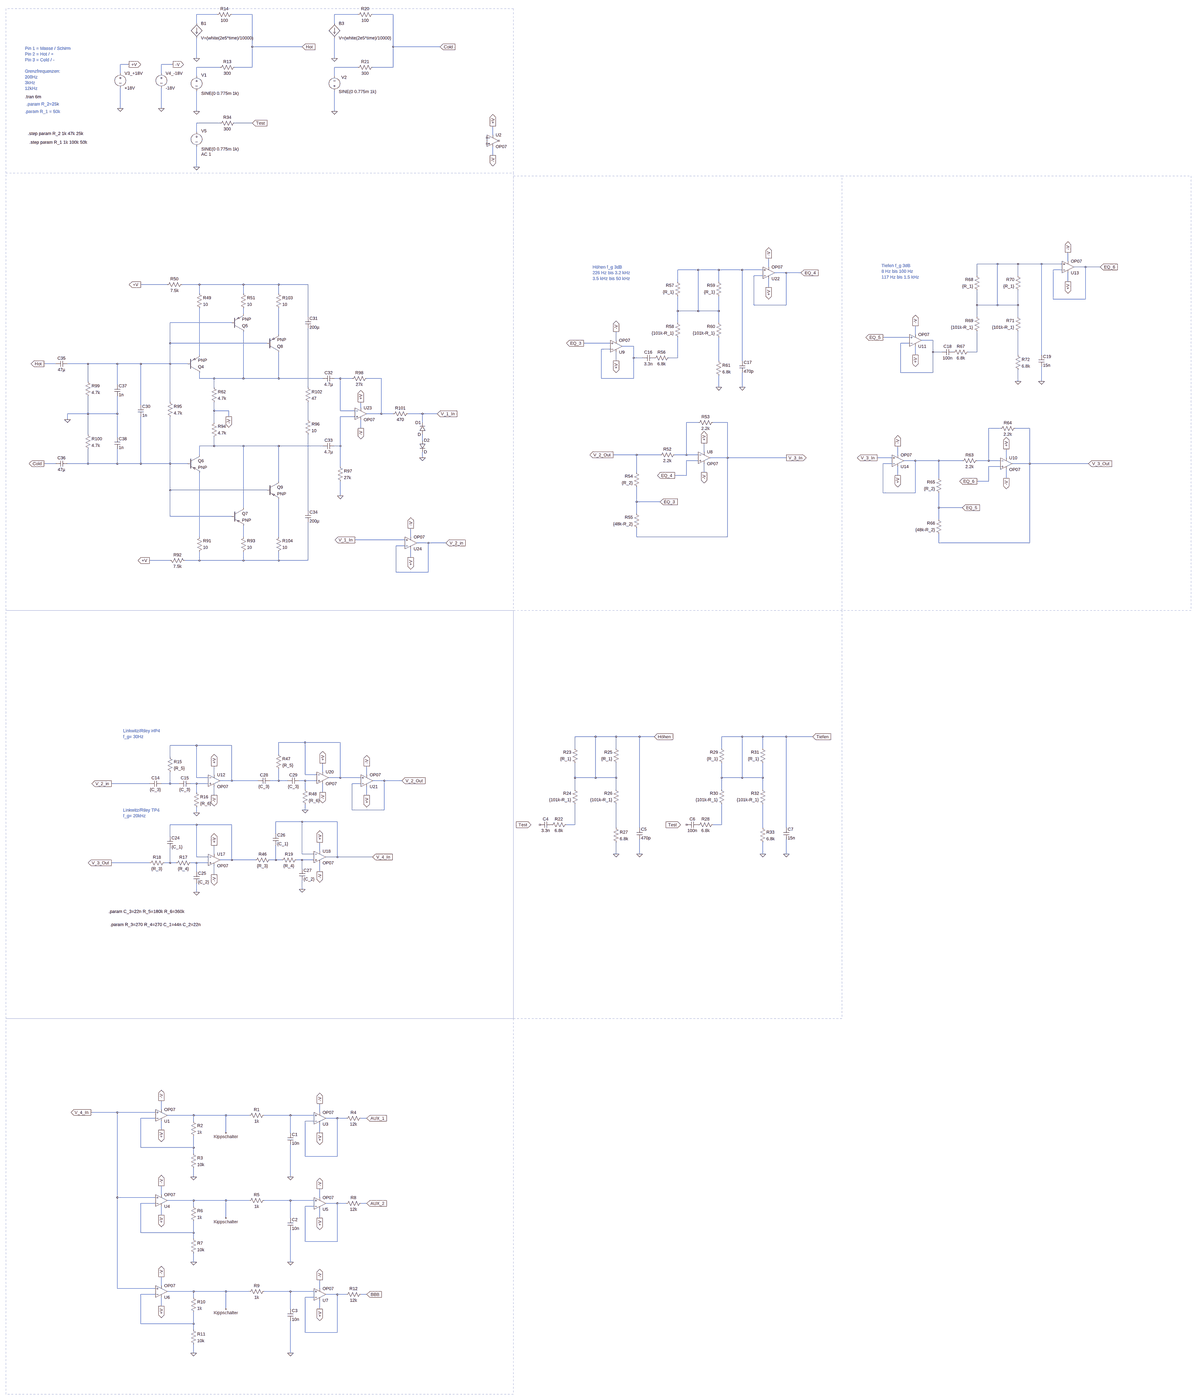
[diagram p0: schematic DiKo_Filter.asc, whole sheet]
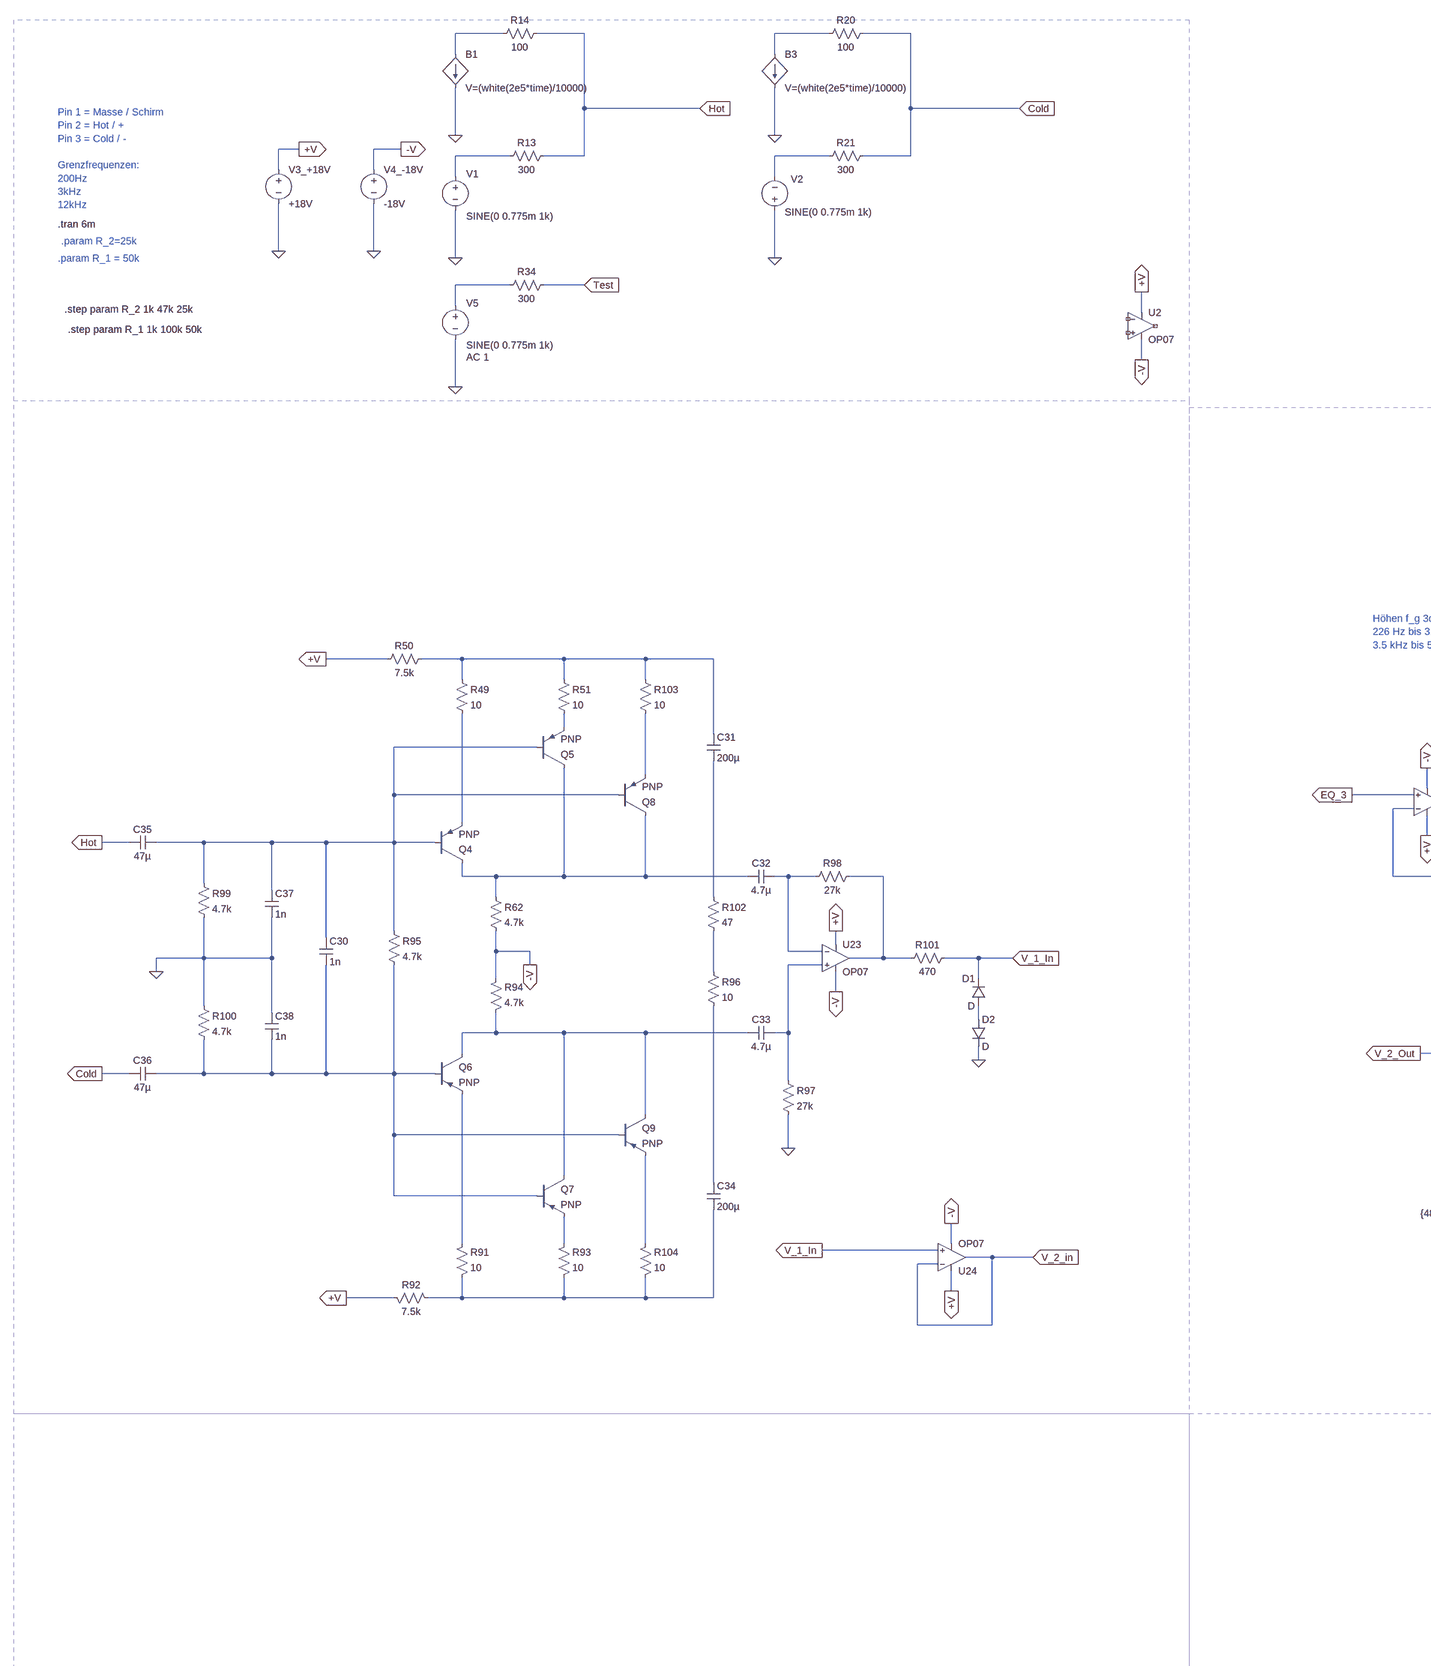
[diagram p1: schematic DiKo_Filter.asc, part, row 1 of 2, column 1 of 2]
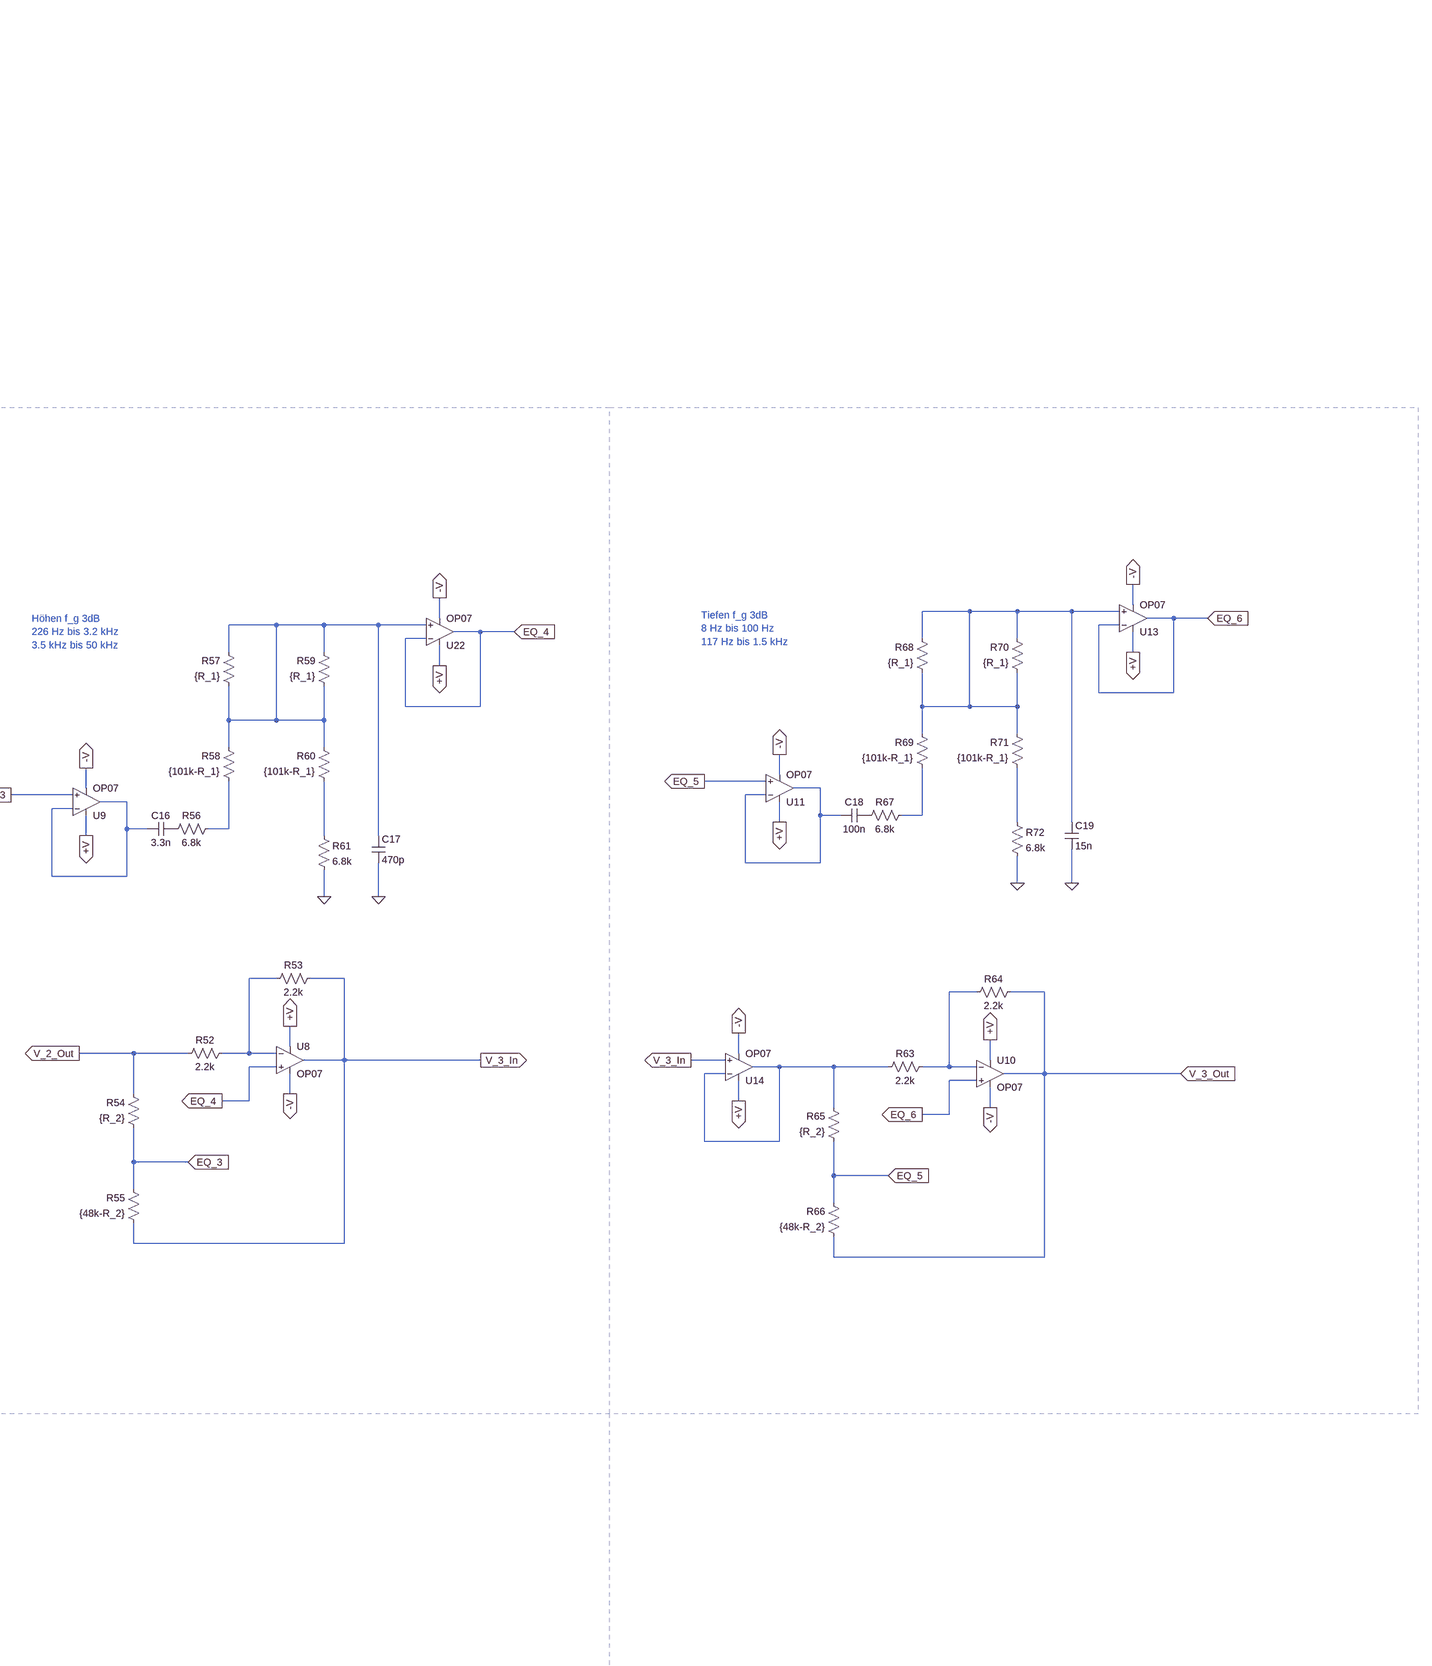
[diagram p2: schematic DiKo_Filter.asc, part, row 1 of 2, column 2 of 2]
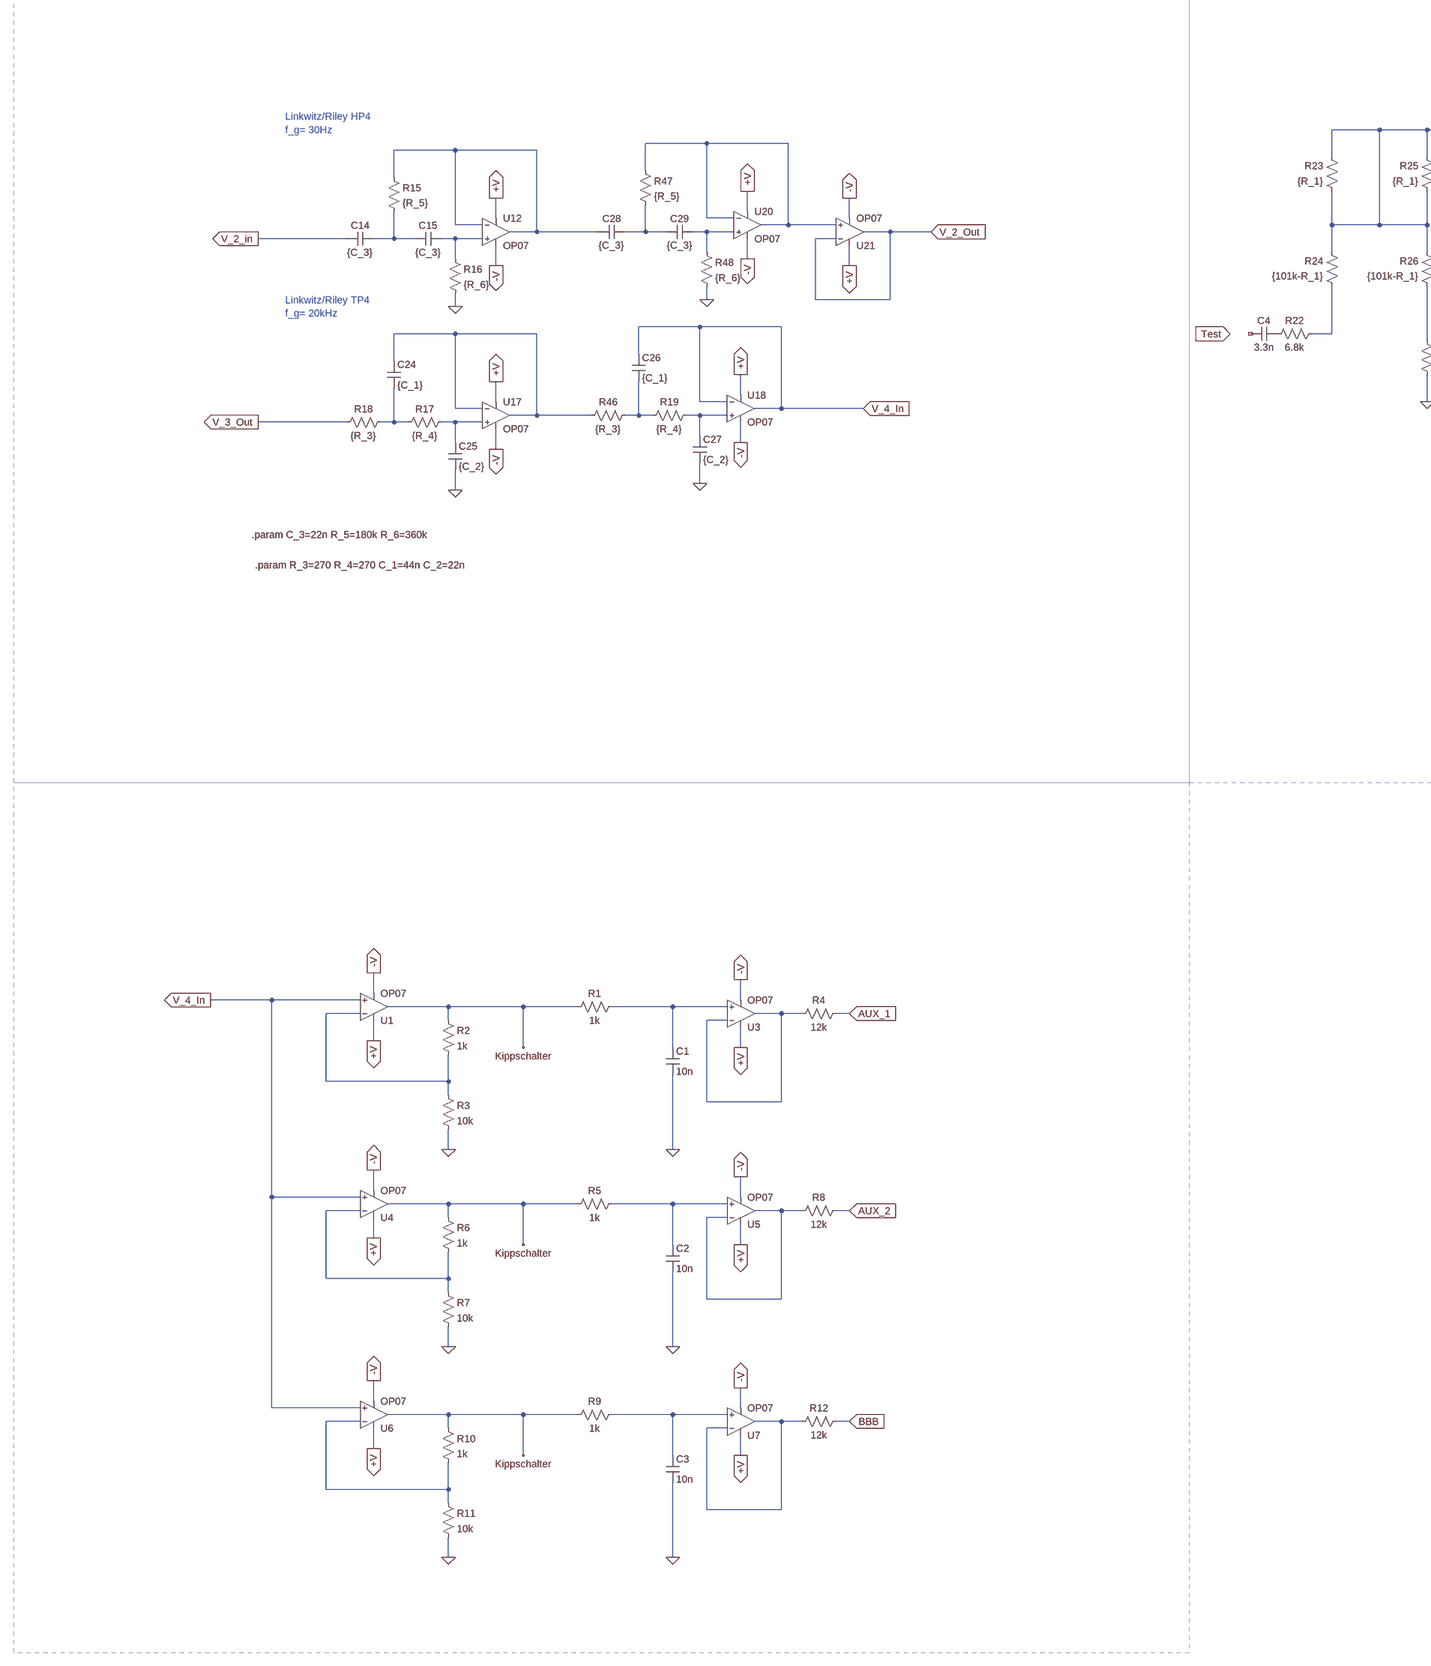
[diagram p3: schematic DiKo_Filter.asc, part, row 2 of 2, column 1 of 2]
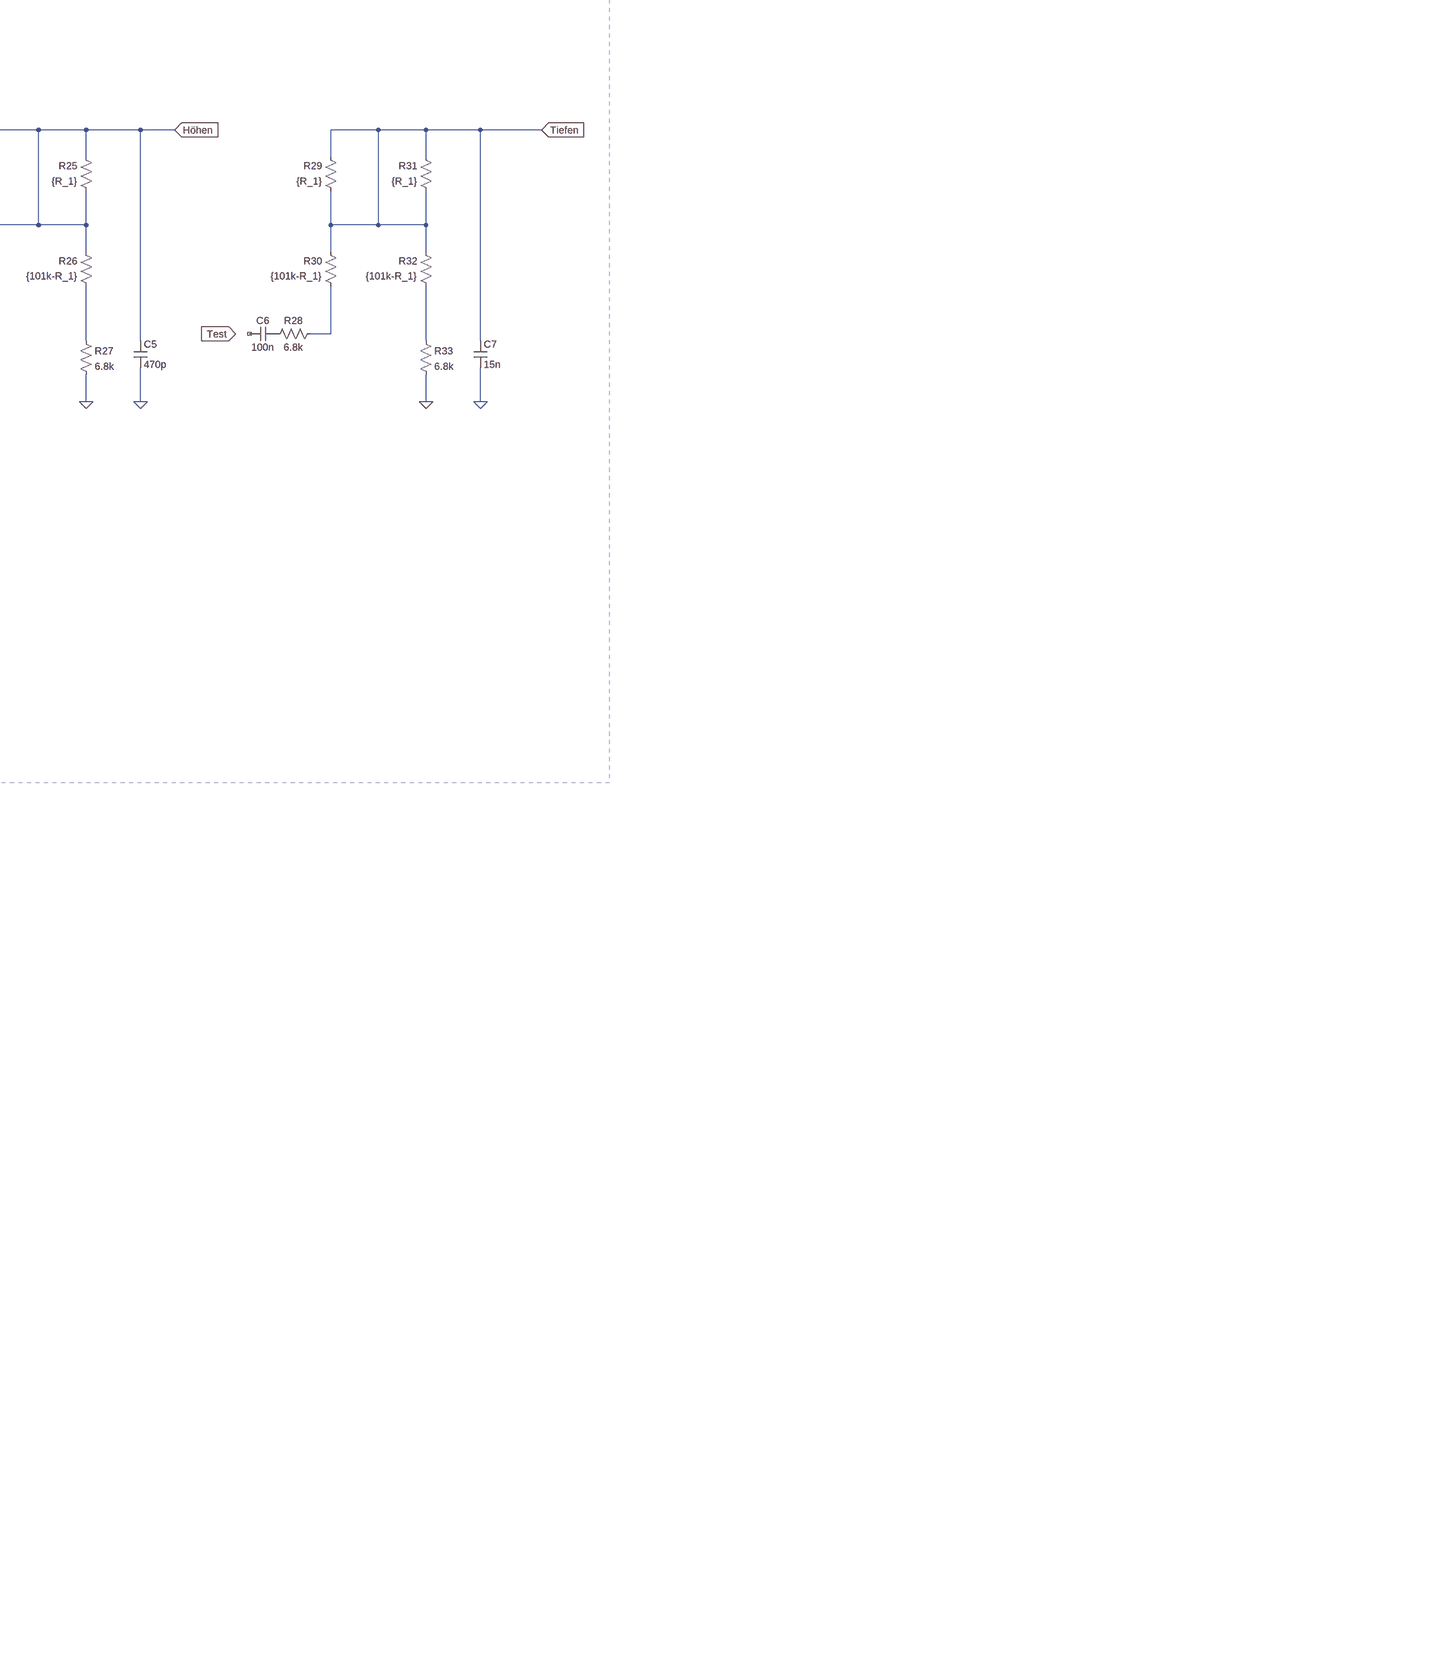
[diagram p4: schematic DiKo_Filter.asc, part, row 2 of 2, column 2 of 2]
DiKo_Filter.asc, the LTspice schematic file:
Version 4
SHEET 1 8660 1460
WIRE 432 -10656 320 -10656
WIRE 624 -10656 512 -10656
WIRE 1200 -10656 1072 -10656
WIRE 1392 -10656 1280 -10656
WIRE 320 -10608 320 -10656
WIRE 1072 -10608 1072 -10656
WIRE 624 -10480 624 -10656
WIRE 896 -10480 624 -10480
WIRE 1392 -10480 1392 -10656
WIRE 1648 -10480 1392 -10480
WIRE 320 -10416 320 -10528
WIRE 1072 -10416 1072 -10528
WIRE -48 -10384 -96 -10384
WIRE 192 -10384 128 -10384
WIRE 448 -10368 320 -10368
WIRE 624 -10368 624 -10480
WIRE 624 -10368 528 -10368
WIRE 1200 -10368 1072 -10368
WIRE 1392 -10368 1392 -10480
WIRE 1392 -10368 1280 -10368
WIRE -96 -10336 -96 -10384
WIRE 128 -10336 128 -10384
WIRE 320 -10320 320 -10368
WIRE 1072 -10320 1072 -10368
WIRE -96 -10144 -96 -10256
WIRE 128 -10144 128 -10256
WIRE 320 -10128 320 -10240
WIRE 1072 -10128 1072 -10240
WIRE 448 -10064 320 -10064
WIRE 624 -10064 528 -10064
WIRE 320 -10016 320 -10064
WIRE 1936 -10000 1936 -10048
WIRE 1936 -9888 1936 -9936
WIRE 320 -9824 320 -9936
WIRE 5072 -9312 5072 -9360
WIRE 4688 -9296 4576 -9296
WIRE 4800 -9296 4688 -9296
WIRE 4928 -9296 4800 -9296
WIRE 5040 -9296 4928 -9296
WIRE 3440 -9280 3440 -9328
WIRE 5168 -9280 5104 -9280
WIRE 5248 -9280 5168 -9280
WIRE 3056 -9264 2944 -9264
WIRE 3168 -9264 3056 -9264
WIRE 3296 -9264 3168 -9264
WIRE 3408 -9264 3296 -9264
WIRE 5040 -9264 4992 -9264
WIRE 3536 -9248 3472 -9248
WIRE 3616 -9248 3536 -9248
WIRE 3408 -9232 3360 -9232
WIRE 4576 -9232 4576 -9296
WIRE 4800 -9232 4800 -9296
WIRE 2944 -9200 2944 -9264
WIRE 3168 -9200 3168 -9264
WIRE 5072 -9200 5072 -9248
WIRE 160 -9184 16 -9184
WIRE 336 -9184 240 -9184
WIRE 576 -9184 336 -9184
WIRE 768 -9184 576 -9184
WIRE 928 -9184 768 -9184
WIRE 3440 -9168 3440 -9216
WIRE 336 -9136 336 -9184
WIRE 576 -9136 576 -9184
WIRE 768 -9136 768 -9184
WIRE 4992 -9104 4992 -9264
WIRE 5168 -9104 5168 -9280
WIRE 5168 -9104 4992 -9104
WIRE 3360 -9072 3360 -9232
WIRE 3536 -9072 3536 -9248
WIRE 3536 -9072 3360 -9072
WIRE 4576 -9072 4576 -9152
WIRE 4688 -9072 4688 -9296
WIRE 4688 -9072 4576 -9072
WIRE 4800 -9072 4800 -9152
WIRE 4800 -9072 4688 -9072
WIRE 2944 -9040 2944 -9120
WIRE 3056 -9040 3056 -9264
WIRE 3056 -9040 2944 -9040
WIRE 3168 -9040 3168 -9120
WIRE 3168 -9040 3056 -9040
WIRE 576 -9024 576 -9056
WIRE 928 -9008 928 -9184
WIRE 4576 -9008 4576 -9072
WIRE 4800 -9008 4800 -9072
WIRE 512 -8976 176 -8976
WIRE 2944 -8976 2944 -9040
WIRE 3168 -8976 3168 -9040
WIRE 768 -8912 768 -9056
WIRE 4240 -8912 4240 -8960
WIRE 4208 -8896 4064 -8896
WIRE 2608 -8880 2608 -8928
WIRE 4336 -8880 4272 -8880
WIRE 176 -8864 176 -8976
WIRE 704 -8864 176 -8864
WIRE 2576 -8864 2432 -8864
WIRE 4208 -8864 4160 -8864
WIRE 2704 -8848 2640 -8848
WIRE 2576 -8832 2528 -8832
WIRE 4336 -8816 4336 -8880
WIRE 4384 -8816 4336 -8816
WIRE 4576 -8816 4576 -8928
WIRE 4576 -8816 4528 -8816
WIRE 336 -8800 336 -9056
WIRE 4240 -8800 4240 -8848
WIRE 4800 -8800 4800 -8928
WIRE 4928 -8800 4928 -9296
WIRE 2704 -8784 2704 -8848
WIRE 2752 -8784 2704 -8784
WIRE 2944 -8784 2944 -8896
WIRE 2944 -8784 2896 -8784
WIRE 2608 -8768 2608 -8816
WIRE 3168 -8768 3168 -8896
WIRE 3296 -8768 3296 -9264
WIRE -448 -8752 -512 -8752
WIRE -272 -8752 -384 -8752
WIRE -112 -8752 -272 -8752
WIRE 16 -8752 -112 -8752
WIRE 176 -8752 176 -8864
WIRE 176 -8752 16 -8752
WIRE 272 -8752 176 -8752
WIRE 4160 -8704 4160 -8864
WIRE 4336 -8704 4336 -8816
WIRE 4336 -8704 4160 -8704
WIRE 336 -8672 336 -8704
WIRE 416 -8672 336 -8672
WIRE 576 -8672 576 -8928
WIRE 576 -8672 416 -8672
WIRE 768 -8672 768 -8816
WIRE 768 -8672 576 -8672
WIRE 1008 -8672 768 -8672
WIRE 1104 -8672 1072 -8672
WIRE 1168 -8672 1104 -8672
WIRE 1328 -8672 1248 -8672
WIRE 2528 -8672 2528 -8832
WIRE 2704 -8672 2704 -8784
WIRE 2704 -8672 2528 -8672
WIRE -272 -8656 -272 -8752
WIRE 4800 -8656 4800 -8720
WIRE 4928 -8656 4928 -8736
WIRE -112 -8640 -112 -8752
WIRE 416 -8624 416 -8672
WIRE 928 -8624 928 -8944
WIRE 3168 -8624 3168 -8688
WIRE 3296 -8624 3296 -8704
WIRE 176 -8544 176 -8752
WIRE 16 -8528 16 -8752
WIRE 1216 -8512 1216 -8544
WIRE 416 -8496 416 -8544
WIRE 496 -8496 416 -8496
WIRE 1104 -8496 1104 -8672
WIRE 1184 -8496 1104 -8496
WIRE -272 -8480 -272 -8576
WIRE -272 -8480 -384 -8480
WIRE -112 -8480 -112 -8576
WIRE -112 -8480 -272 -8480
WIRE 1328 -8480 1328 -8672
WIRE 1328 -8480 1248 -8480
WIRE 1392 -8480 1328 -8480
WIRE 1552 -8480 1472 -8480
WIRE 1632 -8480 1552 -8480
WIRE 496 -8464 496 -8496
WIRE 1184 -8464 1104 -8464
WIRE -384 -8448 -384 -8480
WIRE 928 -8448 928 -8544
WIRE 416 -8432 416 -8496
WIRE 1552 -8432 1552 -8480
WIRE 3056 -8432 2992 -8432
WIRE 3216 -8432 3136 -8432
WIRE 1216 -8400 1216 -8448
WIRE 4704 -8400 4640 -8400
WIRE 4864 -8400 4784 -8400
WIRE -272 -8368 -272 -8480
WIRE -112 -8352 -112 -8480
WIRE 1552 -8336 1552 -8368
WIRE 416 -8304 416 -8352
WIRE 416 -8304 336 -8304
WIRE 576 -8304 416 -8304
WIRE 768 -8304 576 -8304
WIRE 1008 -8304 768 -8304
WIRE 1104 -8304 1104 -8464
WIRE 1104 -8304 1072 -8304
WIRE 3088 -8272 3088 -8320
WIRE 336 -8256 336 -8304
WIRE 2720 -8256 2592 -8256
WIRE 2848 -8256 2720 -8256
WIRE 2992 -8256 2992 -8432
WIRE 2992 -8256 2928 -8256
WIRE 3056 -8256 2992 -8256
WIRE 4144 -8256 4144 -8304
WIRE 1552 -8240 1552 -8272
WIRE 3216 -8240 3216 -8432
WIRE 3216 -8240 3120 -8240
WIRE 3536 -8240 3216 -8240
WIRE 4112 -8240 4032 -8240
WIRE 4736 -8240 4736 -8288
WIRE 3056 -8224 2992 -8224
WIRE 4240 -8224 4176 -8224
WIRE 4368 -8224 4240 -8224
WIRE 4496 -8224 4368 -8224
WIRE 4640 -8224 4640 -8400
WIRE 4640 -8224 4576 -8224
WIRE 4704 -8224 4640 -8224
WIRE -448 -8208 -512 -8208
WIRE -272 -8208 -272 -8288
WIRE -272 -8208 -384 -8208
WIRE -112 -8208 -112 -8288
WIRE -112 -8208 -272 -8208
WIRE 16 -8208 16 -8464
WIRE 16 -8208 -112 -8208
WIRE 176 -8208 176 -8464
WIRE 176 -8208 16 -8208
WIRE 272 -8208 176 -8208
WIRE 4112 -8208 4064 -8208
WIRE 4864 -8208 4864 -8400
WIRE 4864 -8208 4768 -8208
WIRE 5184 -8208 4864 -8208
WIRE 1104 -8192 1104 -8304
WIRE 4704 -8192 4640 -8192
WIRE 2720 -8160 2720 -8256
WIRE 3088 -8160 3088 -8208
WIRE 2992 -8144 2992 -8224
WIRE 2992 -8144 2928 -8144
WIRE 4144 -8144 4144 -8192
WIRE 4368 -8128 4368 -8224
WIRE 4736 -8128 4736 -8176
WIRE 768 -8112 768 -8304
WIRE 4640 -8112 4640 -8192
WIRE 4640 -8112 4576 -8112
WIRE 176 -8064 176 -8208
WIRE 704 -8064 176 -8064
WIRE 4064 -8048 4064 -8208
WIRE 4240 -8048 4240 -8224
WIRE 4240 -8048 4064 -8048
WIRE 1104 -8032 1104 -8112
WIRE 2720 -8000 2720 -8080
WIRE 2848 -8000 2720 -8000
WIRE 576 -7968 576 -8304
WIRE 4368 -7968 4368 -8048
WIRE 4496 -7968 4368 -7968
WIRE 928 -7952 928 -8368
WIRE 2720 -7936 2720 -8000
WIRE 176 -7920 176 -8064
WIRE 512 -7920 176 -7920
WIRE 4368 -7904 4368 -7968
WIRE 336 -7808 336 -8160
WIRE 576 -7808 576 -7872
WIRE 768 -7808 768 -8016
WIRE 1488 -7808 1488 -7856
WIRE 2720 -7808 2720 -7856
WIRE 3216 -7808 3216 -8240
WIRE 3216 -7808 2720 -7808
WIRE 1456 -7792 1184 -7792
WIRE 1584 -7776 1520 -7776
WIRE 1680 -7776 1584 -7776
WIRE 4368 -7776 4368 -7824
WIRE 4864 -7776 4864 -8208
WIRE 4864 -7776 4368 -7776
WIRE 1456 -7760 1408 -7760
WIRE 1488 -7696 1488 -7744
WIRE 176 -7680 64 -7680
WIRE 336 -7680 336 -7728
WIRE 336 -7680 256 -7680
WIRE 576 -7680 576 -7728
WIRE 576 -7680 336 -7680
WIRE 768 -7680 768 -7728
WIRE 768 -7680 576 -7680
WIRE 928 -7680 928 -7888
WIRE 928 -7680 768 -7680
WIRE 1408 -7616 1408 -7760
WIRE 1584 -7616 1584 -7776
WIRE 1584 -7616 1408 -7616
WIRE 2496 -6720 2384 -6720
WIRE 2608 -6720 2496 -6720
WIRE 2736 -6720 2608 -6720
WIRE 2816 -6720 2736 -6720
WIRE 3296 -6720 3184 -6720
WIRE 3408 -6720 3296 -6720
WIRE 3536 -6720 3408 -6720
WIRE 3680 -6720 3536 -6720
WIRE 912 -6688 768 -6688
WIRE 1104 -6688 912 -6688
WIRE 320 -6672 176 -6672
WIRE 512 -6672 320 -6672
WIRE 2384 -6656 2384 -6720
WIRE 2608 -6656 2608 -6720
WIRE 3184 -6656 3184 -6720
WIRE 3408 -6656 3408 -6720
WIRE 768 -6624 768 -6688
WIRE 176 -6608 176 -6672
WIRE 1008 -6528 1008 -6576
WIRE 416 -6512 416 -6560
WIRE 912 -6512 912 -6688
WIRE 976 -6512 912 -6512
WIRE 1248 -6512 1248 -6560
WIRE 320 -6496 320 -6672
WIRE 384 -6496 320 -6496
WIRE 1104 -6496 1104 -6688
WIRE 1104 -6496 1040 -6496
WIRE 1216 -6496 1104 -6496
WIRE 2384 -6496 2384 -6576
WIRE 2496 -6496 2496 -6720
WIRE 2496 -6496 2384 -6496
WIRE 2608 -6496 2608 -6576
WIRE 2608 -6496 2496 -6496
WIRE 3184 -6496 3184 -6576
WIRE 3296 -6496 3296 -6720
WIRE 3296 -6496 3184 -6496
WIRE 3408 -6496 3408 -6576
WIRE 3408 -6496 3296 -6496
WIRE 512 -6480 512 -6672
WIRE 512 -6480 448 -6480
WIRE 656 -6480 512 -6480
WIRE 768 -6480 768 -6544
WIRE 768 -6480 720 -6480
WIRE 816 -6480 768 -6480
WIRE 912 -6480 880 -6480
WIRE 976 -6480 912 -6480
WIRE 1344 -6480 1280 -6480
WIRE 1440 -6480 1344 -6480
WIRE 64 -6464 -144 -6464
WIRE 176 -6464 176 -6528
WIRE 176 -6464 128 -6464
WIRE 224 -6464 176 -6464
WIRE 320 -6464 288 -6464
WIRE 384 -6464 320 -6464
WIRE 1216 -6464 1168 -6464
WIRE 912 -6432 912 -6480
WIRE 2384 -6432 2384 -6496
WIRE 2608 -6432 2608 -6496
WIRE 3184 -6432 3184 -6496
WIRE 3408 -6432 3408 -6496
WIRE 320 -6416 320 -6464
WIRE 1008 -6416 1008 -6464
WIRE 416 -6400 416 -6448
WIRE 1248 -6400 1248 -6448
WIRE 912 -6320 912 -6352
WIRE 1168 -6320 1168 -6464
WIRE 1344 -6320 1344 -6480
WIRE 1344 -6320 1168 -6320
WIRE 320 -6304 320 -6336
WIRE 896 -6256 752 -6256
WIRE 1088 -6256 896 -6256
WIRE 320 -6240 176 -6240
WIRE 512 -6240 320 -6240
WIRE 2384 -6240 2384 -6352
WIRE 2384 -6240 2336 -6240
WIRE 3184 -6240 3184 -6352
WIRE 3184 -6240 3136 -6240
WIRE 2608 -6224 2608 -6352
WIRE 2736 -6224 2736 -6720
WIRE 3408 -6224 3408 -6352
WIRE 3536 -6224 3536 -6720
WIRE 752 -6192 752 -6256
WIRE 176 -6176 176 -6240
WIRE 992 -6096 992 -6144
WIRE 416 -6080 416 -6128
WIRE 896 -6080 896 -6256
WIRE 960 -6080 896 -6080
WIRE 2608 -6080 2608 -6144
WIRE 2736 -6080 2736 -6160
WIRE 3408 -6080 3408 -6144
WIRE 3536 -6080 3536 -6160
WIRE 320 -6064 320 -6240
WIRE 384 -6064 320 -6064
WIRE 1088 -6064 1088 -6256
WIRE 1088 -6064 1024 -6064
WIRE 1280 -6064 1088 -6064
WIRE 512 -6048 512 -6240
WIRE 512 -6048 448 -6048
WIRE 640 -6048 512 -6048
WIRE 752 -6048 752 -6128
WIRE 752 -6048 720 -6048
WIRE 784 -6048 752 -6048
WIRE 896 -6048 864 -6048
WIRE 960 -6048 896 -6048
WIRE 64 -6032 -144 -6032
WIRE 176 -6032 176 -6112
WIRE 176 -6032 144 -6032
WIRE 208 -6032 176 -6032
WIRE 320 -6032 288 -6032
WIRE 384 -6032 320 -6032
WIRE 896 -6000 896 -6048
WIRE 320 -5984 320 -6032
WIRE 992 -5984 992 -6032
WIRE 416 -5968 416 -6016
WIRE 896 -5888 896 -5936
WIRE 320 -5872 320 -5920
WIRE 128 -4688 128 -4736
WIRE -112 -4672 -256 -4672
WIRE 96 -4672 -112 -4672
WIRE 992 -4672 992 -4720
WIRE 304 -4656 160 -4656
WIRE 480 -4656 304 -4656
WIRE 608 -4656 480 -4656
WIRE 832 -4656 688 -4656
WIRE 960 -4656 832 -4656
WIRE 96 -4640 16 -4640
WIRE 1088 -4640 1024 -4640
WIRE 1136 -4640 1088 -4640
WIRE 1248 -4640 1216 -4640
WIRE 304 -4624 304 -4656
WIRE 960 -4624 912 -4624
WIRE 128 -4576 128 -4624
WIRE 480 -4560 480 -4656
WIRE 832 -4560 832 -4656
WIRE 992 -4560 992 -4608
WIRE 16 -4480 16 -4640
WIRE 304 -4480 304 -4544
WIRE 304 -4480 16 -4480
WIRE 304 -4448 304 -4480
WIRE 912 -4432 912 -4624
WIRE 1088 -4432 1088 -4640
WIRE 1088 -4432 912 -4432
WIRE 304 -4320 304 -4368
WIRE 832 -4320 832 -4496
WIRE 128 -4224 128 -4272
WIRE -112 -4208 -112 -4672
WIRE 96 -4208 -112 -4208
WIRE 992 -4208 992 -4256
WIRE 304 -4192 160 -4192
WIRE 480 -4192 304 -4192
WIRE 608 -4192 480 -4192
WIRE 832 -4192 688 -4192
WIRE 960 -4192 832 -4192
WIRE 96 -4176 16 -4176
WIRE 1088 -4176 1024 -4176
WIRE 1136 -4176 1088 -4176
WIRE 1248 -4176 1216 -4176
WIRE 304 -4160 304 -4192
WIRE 960 -4160 912 -4160
WIRE 128 -4112 128 -4160
WIRE 480 -4096 480 -4192
WIRE 832 -4096 832 -4192
WIRE 992 -4096 992 -4144
WIRE 16 -4016 16 -4176
WIRE 304 -4016 304 -4080
WIRE 304 -4016 16 -4016
WIRE 304 -3984 304 -4016
WIRE 912 -3968 912 -4160
WIRE 1088 -3968 1088 -4176
WIRE 1088 -3968 912 -3968
WIRE 304 -3856 304 -3904
WIRE 832 -3856 832 -4032
WIRE 128 -3728 128 -3776
WIRE -112 -3712 -112 -4208
WIRE 96 -3712 -112 -3712
WIRE 992 -3712 992 -3760
WIRE 304 -3696 160 -3696
WIRE 480 -3696 304 -3696
WIRE 608 -3696 480 -3696
WIRE 832 -3696 688 -3696
WIRE 960 -3696 832 -3696
WIRE 96 -3680 16 -3680
WIRE 1088 -3680 1024 -3680
WIRE 1136 -3680 1088 -3680
WIRE 1248 -3680 1216 -3680
WIRE 304 -3664 304 -3696
WIRE 960 -3664 912 -3664
WIRE 128 -3616 128 -3664
WIRE 480 -3600 480 -3696
WIRE 832 -3600 832 -3696
WIRE 992 -3600 992 -3648
WIRE 16 -3520 16 -3680
WIRE 304 -3520 304 -3584
WIRE 304 -3520 16 -3520
WIRE 304 -3488 304 -3520
WIRE 912 -3472 912 -3664
WIRE 1088 -3472 1088 -3680
WIRE 1088 -3472 912 -3472
WIRE 304 -3360 304 -3408
WIRE 832 -3360 832 -3536
FLAG 320 -10128 0
FLAG -96 -10144 0
FLAG 128 -10144 0
FLAG -48 -10384 +V
IOPIN -48 -10384 Out
FLAG 192 -10384 -V
IOPIN 192 -10384 Out
FLAG 1936 -10048 +V
IOPIN 1936 -10048 Out
FLAG 1936 -9888 -V
IOPIN 1936 -9888 Out
FLAG 3088 -8320 +V
IOPIN 3088 -8320 Out
FLAG 3088 -8160 -V
IOPIN 3088 -8160 Out
FLAG -144 -6464 V_2_in
IOPIN -144 -6464 Out
FLAG 2848 -8000 EQ_3
IOPIN 2848 -8000 In
FLAG 2928 -8144 EQ_4
IOPIN 2928 -8144 Out
FLAG 3168 -8624 0
FLAG 3296 -8624 0
FLAG 2608 -8768 +V
IOPIN 2608 -8768 Out
FLAG 2608 -8928 -V
IOPIN 2608 -8928 Out
FLAG 2432 -8864 EQ_3
IOPIN 2432 -8864 Out
FLAG 3616 -9248 EQ_4
IOPIN 3616 -9248 In
FLAG 4736 -8288 +V
IOPIN 4736 -8288 Out
FLAG 4736 -8128 -V
IOPIN 4736 -8128 Out
FLAG 4496 -7968 EQ_5
IOPIN 4496 -7968 In
FLAG 4576 -8112 EQ_6
IOPIN 4576 -8112 Out
FLAG 4800 -8656 0
FLAG 4928 -8656 0
FLAG 4240 -8800 +V
IOPIN 4240 -8800 Out
FLAG 4240 -8960 -V
IOPIN 4240 -8960 Out
FLAG 4064 -8896 EQ_5
IOPIN 4064 -8896 Out
FLAG 5248 -9280 EQ_6
IOPIN 5248 -9280 In
FLAG 416 -6560 +V
IOPIN 416 -6560 Out
FLAG 416 -6400 -V
IOPIN 416 -6400 Out
FLAG 320 -6304 0
FLAG 416 -6128 +V
IOPIN 416 -6128 Out
FLAG 416 -5968 -V
IOPIN 416 -5968 Out
FLAG 320 -5872 0
FLAG 992 -6144 +V
IOPIN 992 -6144 Out
FLAG 992 -5984 -V
IOPIN 992 -5984 Out
FLAG 896 -5888 0
FLAG 1008 -6576 +V
IOPIN 1008 -6576 Out
FLAG 1008 -6416 -V
IOPIN 1008 -6416 Out
FLAG 1248 -6400 +V
IOPIN 1248 -6400 Out
FLAG 1248 -6560 -V
IOPIN 1248 -6560 Out
FLAG 912 -6320 0
FLAG 3440 -9168 +V
IOPIN 3440 -9168 Out
FLAG 3440 -9328 -V
IOPIN 3440 -9328 Out
FLAG 1184 -7792 V_1_In
IOPIN 1184 -7792 Out
FLAG 5184 -8208 V_3_Out
IOPIN 5184 -8208 In
FLAG 3536 -8240 V_3_In
IOPIN 3536 -8240 Out
FLAG 2592 -8256 V_2_Out
IOPIN 2592 -8256 Out
FLAG 1440 -6480 V_2_Out
IOPIN 1440 -6480 In
FLAG 1488 -7696 +V
IOPIN 1488 -7696 Out
FLAG 1488 -7856 -V
IOPIN 1488 -7856 Out
FLAG 1680 -7776 V_2_in
IOPIN 1680 -7776 In
FLAG -144 -6032 V_3_Out
IOPIN -144 -6032 Out
FLAG 1280 -6064 V_4_In
IOPIN 1280 -6064 In
FLAG 1072 -10128 0
FLAG 1648 -10480 Cold
IOPIN 1648 -10480 In
FLAG -512 -8752 Hot
IOPIN -512 -8752 Out
FLAG -512 -8208 Cold
IOPIN -512 -8208 Out
FLAG 16 -9184 +V
IOPIN 16 -9184 Out
FLAG 64 -7680 +V
IOPIN 64 -7680 Out
FLAG 496 -8464 -V
IOPIN 496 -8464 Out
FLAG 1216 -8544 +V
IOPIN 1216 -8544 Out
FLAG 1216 -8400 -V
IOPIN 1216 -8400 Out
FLAG 1104 -8032 0
FLAG -384 -8448 0
FLAG 1632 -8480 V_1_In
IOPIN 1632 -8480 In
FLAG 1552 -8240 0
FLAG -256 -4672 V_4_In
IOPIN -256 -4672 Out
FLAG 1248 -4640 AUX_1
IOPIN 1248 -4640 In
FLAG 128 -4576 +V
IOPIN 128 -4576 Out
FLAG 128 -4736 -V
IOPIN 128 -4736 Out
FLAG 832 -4320 0
FLAG 992 -4560 +V
IOPIN 992 -4560 Out
FLAG 992 -4720 -V
IOPIN 992 -4720 Out
FLAG 304 -4320 0
FLAG 128 -4112 +V
IOPIN 128 -4112 Out
FLAG 128 -4272 -V
IOPIN 128 -4272 Out
FLAG 832 -3856 0
FLAG 992 -4096 +V
IOPIN 992 -4096 Out
FLAG 992 -4256 -V
IOPIN 992 -4256 Out
FLAG 304 -3856 0
FLAG 1248 -4176 AUX_2
IOPIN 1248 -4176 In
FLAG 128 -3616 +V
IOPIN 128 -3616 Out
FLAG 128 -3776 -V
IOPIN 128 -3776 Out
FLAG 832 -3360 0
FLAG 992 -3600 +V
IOPIN 992 -3600 Out
FLAG 992 -3760 -V
IOPIN 992 -3760 Out
FLAG 304 -3360 0
FLAG 1248 -3680 BBB
IOPIN 1248 -3680 In
FLAG 5072 -9200 +V
IOPIN 5072 -9200 Out
FLAG 5072 -9360 -V
IOPIN 5072 -9360 Out
FLAG 480 -4560 Kippschalter
FLAG 480 -4096 Kippschalter
FLAG 480 -3600 Kippschalter
FLAG 4144 -8144 +V
IOPIN 4144 -8144 Out
FLAG 4144 -8304 -V
IOPIN 4144 -8304 Out
FLAG 4032 -8240 V_3_In
IOPIN 4032 -8240 Out
FLAG 320 -10416 0
FLAG 896 -10480 Hot
IOPIN 896 -10480 In
FLAG 1072 -10416 0
FLAG 2608 -6080 0
FLAG 2736 -6080 0
FLAG 2144 -6240 Test
IOPIN 2144 -6240 In
FLAG 3408 -6080 0
FLAG 3536 -6080 0
FLAG 2960 -6240 Test
IOPIN 2960 -6240 In
FLAG 320 -9824 0
FLAG 624 -10064 Test
IOPIN 624 -10064 In
FLAG 2816 -6720 Höhen
IOPIN 2816 -6720 In
FLAG 3680 -6720 Tiefen
IOPIN 3680 -6720 In
SYMBOL voltage 320 -10336 R0
WINDOW 123 26 137 Left 2
WINDOW 39 0 0 Left 0
WINDOW 3 26 109 Left 2
WINDOW 0 26 10 Left 2
SYMATTR Value SINE(0 0.775m 1k)
SYMATTR InstName V1
SYMBOL voltage -96 -10352 R0
WINDOW 123 0 0 Left 0
WINDOW 39 0 0 Left 0
SYMATTR InstName V3_+18V
SYMATTR Value +18V
SYMBOL voltage 128 -10352 R0
WINDOW 123 0 0 Left 0
WINDOW 39 0 0 Left 0
SYMATTR InstName V4_-18V
SYMATTR Value -18V
SYMBOL OpAmps\\OP07 1936 -10032 R0
SYMATTR InstName U2
SYMBOL OpAmps\\OP07 3088 -8304 R0
SYMATTR InstName U8
SYMBOL res 2944 -8272 R90
WINDOW 0 0 56 VBottom 2
WINDOW 3 32 56 VTop 2
SYMATTR InstName R52
SYMATTR Value 2.2k
SYMBOL res 3152 -8448 R90
WINDOW 0 0 56 VBottom 2
WINDOW 3 32 56 VTop 2
SYMATTR InstName R53
SYMATTR Value 2.2k
SYMBOL res 2736 -8064 R180
WINDOW 0 36 76 Left 2
WINDOW 3 36 40 Left 2
SYMATTR InstName R54
SYMATTR Value {R_2}
SYMBOL res 2736 -7840 R180
WINDOW 0 36 76 Left 2
WINDOW 3 36 40 Left 2
SYMATTR InstName R55
SYMATTR Value {48k-R_2}
SYMBOL cap 2816 -8800 R90
WINDOW 0 0 32 VBottom 2
WINDOW 3 32 32 VTop 2
SYMATTR InstName C16
SYMATTR Value 3.3n
SYMBOL res 2912 -8800 R90
WINDOW 0 0 56 VBottom 2
WINDOW 3 32 56 VTop 2
SYMATTR InstName R56
SYMATTR Value 6.8k
SYMBOL res 2960 -9104 R180
WINDOW 0 36 76 Left 2
WINDOW 3 36 40 Left 2
SYMATTR InstName R57
SYMATTR Value {R_1}
SYMBOL res 2960 -8880 R180
WINDOW 0 36 76 Left 2
WINDOW 3 36 40 Left 2
SYMATTR InstName R58
SYMATTR Value {101k-R_1}
SYMBOL res 3184 -9104 R180
WINDOW 0 36 76 Left 2
WINDOW 3 36 40 Left 2
SYMATTR InstName R59
SYMATTR Value {R_1}
SYMBOL res 3184 -8880 R180
WINDOW 0 36 76 Left 2
WINDOW 3 36 40 Left 2
SYMATTR InstName R60
SYMATTR Value {101k-R_1}
SYMBOL res 3152 -8784 R0
SYMATTR InstName R61
SYMATTR Value 6.8k
SYMBOL cap 3280 -8768 R0
SYMATTR InstName C17
SYMATTR Value 470p
SYMBOL OpAmps\\OP07 2608 -8784 M180
SYMATTR InstName U9
SYMBOL OpAmps\\OP07 4736 -8272 R0
SYMATTR InstName U10
SYMBOL res 4592 -8240 R90
WINDOW 0 0 56 VBottom 2
WINDOW 3 32 56 VTop 2
SYMATTR InstName R63
SYMATTR Value 2.2k
SYMBOL res 4800 -8416 R90
WINDOW 0 0 56 VBottom 2
WINDOW 3 32 56 VTop 2
SYMATTR InstName R64
SYMATTR Value 2.2k
SYMBOL res 4384 -8032 R180
WINDOW 0 36 76 Left 2
WINDOW 3 36 40 Left 2
SYMATTR InstName R65
SYMATTR Value {R_2}
SYMBOL res 4384 -7808 R180
WINDOW 0 36 76 Left 2
WINDOW 3 36 40 Left 2
SYMATTR InstName R66
SYMATTR Value {48k-R_2}
SYMBOL cap 4448 -8832 R90
WINDOW 0 0 32 VBottom 2
WINDOW 3 32 32 VTop 2
SYMATTR InstName C18
SYMATTR Value 100n
SYMBOL res 4544 -8832 R90
WINDOW 0 0 56 VBottom 2
WINDOW 3 32 56 VTop 2
SYMATTR InstName R67
SYMATTR Value 6.8k
SYMBOL res 4592 -9136 R180
WINDOW 0 36 76 Left 2
WINDOW 3 36 40 Left 2
SYMATTR InstName R68
SYMATTR Value {R_1}
SYMBOL res 4592 -8912 R180
WINDOW 0 36 76 Left 2
WINDOW 3 36 40 Left 2
SYMATTR InstName R69
SYMATTR Value {101k-R_1}
SYMBOL res 4816 -9136 R180
WINDOW 0 36 76 Left 2
WINDOW 3 36 40 Left 2
SYMATTR InstName R70
SYMATTR Value {R_1}
SYMBOL res 4816 -8912 R180
WINDOW 0 36 76 Left 2
WINDOW 3 36 40 Left 2
SYMATTR InstName R71
SYMATTR Value {101k-R_1}
SYMBOL res 4784 -8816 R0
SYMATTR InstName R72
SYMATTR Value 6.8k
SYMBOL cap 4912 -8800 R0
SYMATTR InstName C19
SYMATTR Value 15n
SYMBOL OpAmps\\OP07 4240 -8816 M180
SYMATTR InstName U11
SYMBOL OpAmps\\OP07 416 -6544 R0
SYMATTR InstName U12
SYMBOL cap 128 -6480 R90
WINDOW 0 0 32 VBottom 2
WINDOW 3 32 32 VTop 2
SYMATTR InstName C14
SYMATTR Value {C_3}
SYMBOL cap 288 -6480 R90
WINDOW 0 0 32 VBottom 2
WINDOW 3 32 32 VTop 2
SYMATTR InstName C15
SYMATTR Value {C_3}
SYMBOL res 160 -6624 R0
SYMATTR InstName R15
SYMATTR Value {R_5}
SYMBOL res 304 -6432 R0
SYMATTR InstName R16
SYMATTR Value {R_6}
SYMBOL OpAmps\\OP07 416 -6112 R0
SYMATTR InstName U17
SYMBOL res 304 -6048 R90
WINDOW 0 0 56 VBottom 2
WINDOW 3 32 56 VTop 2
SYMATTR InstName R17
SYMATTR Value {R_4}
SYMBOL res 160 -6048 R90
WINDOW 0 0 56 VBottom 2
WINDOW 3 32 56 VTop 2
SYMATTR InstName R18
SYMATTR Value {R_3}
SYMBOL cap 160 -6176 R0
SYMATTR InstName C24
SYMATTR Value {C_1}
SYMBOL cap 304 -5984 R0
SYMATTR InstName C25
SYMATTR Value {C_2}
SYMBOL OpAmps\\OP07 992 -6128 R0
SYMATTR InstName U18
SYMBOL res 880 -6064 R90
WINDOW 0 0 56 VBottom 2
WINDOW 3 32 56 VTop 2
SYMATTR InstName R19
SYMATTR Value {R_4}
SYMBOL res 736 -6064 R90
WINDOW 0 0 56 VBottom 2
WINDOW 3 32 56 VTop 2
SYMATTR InstName R46
SYMATTR Value {R_3}
SYMBOL cap 736 -6192 R0
SYMATTR InstName C26
SYMATTR Value {C_1}
SYMBOL cap 880 -6000 R0
SYMATTR InstName C27
SYMATTR Value {C_2}
SYMBOL OpAmps\\OP07 1008 -6560 R0
SYMATTR InstName U20
SYMBOL cap 720 -6496 R90
WINDOW 0 0 32 VBottom 2
WINDOW 3 32 32 VTop 2
SYMATTR InstName C28
SYMATTR Value {C_3}
SYMBOL cap 880 -6496 R90
WINDOW 0 0 32 VBottom 2
WINDOW 3 32 32 VTop 2
SYMATTR InstName C29
SYMATTR Value {C_3}
SYMBOL res 752 -6640 R0
SYMATTR InstName R47
SYMATTR Value {R_5}
SYMBOL OpAmps\\OP07 1248 -6416 M180
SYMATTR InstName U21
SYMBOL res 896 -6448 R0
SYMATTR InstName R48
SYMATTR Value {R_6}
SYMBOL OpAmps\\OP07 3440 -9184 M180
SYMATTR InstName U22
SYMBOL OpAmps\\OP07 1488 -7712 M180
SYMATTR InstName U24
SYMBOL voltage 1072 -10224 R180
WINDOW 123 -229 -16 Left 2
WINDOW 39 0 0 Left 0
WINDOW 3 -229 12 Left 2
WINDOW 0 -67 90 Left 2
SYMATTR Value SINE(0 0.775m 1k)
SYMATTR InstName V2
SYMBOL pnp 272 -8704 M180
SYMATTR InstName Q4
SYMBOL pnp 512 -8928 M180
SYMATTR InstName Q5
SYMBOL res 320 -9152 R0
SYMATTR InstName R49
SYMATTR Value 10
SYMBOL res 256 -9200 R90
WINDOW 0 0 56 VBottom 2
WINDOW 3 32 56 VTop 2
SYMATTR InstName R50
SYMATTR Value 7.5k
SYMBOL res 560 -9152 R0
SYMATTR InstName R51
SYMATTR Value 10
SYMBOL res 400 -8640 R0
SYMATTR InstName R62
SYMATTR Value 4.7k
SYMBOL pnp 272 -8256 R0
SYMATTR InstName Q6
SYMBOL pnp 512 -7968 R0
SYMATTR InstName Q7
SYMBOL res 320 -7712 M180
WINDOW 0 36 76 Left 2
WINDOW 3 36 40 Left 2
SYMATTR InstName R91
SYMATTR Value 10
SYMBOL res 272 -7664 M270
WINDOW 0 32 56 VTop 2
WINDOW 3 0 56 VBottom 2
SYMATTR InstName R92
SYMATTR Value 7.5k
SYMBOL res 560 -7712 M180
WINDOW 0 36 76 Left 2
WINDOW 3 36 40 Left 2
SYMATTR InstName R93
SYMATTR Value 10
SYMBOL res 400 -8336 M180
WINDOW 0 36 76 Left 2
WINDOW 3 36 40 Left 2
SYMATTR InstName R94
SYMATTR Value 4.7k
SYMBOL res 160 -8560 R0
SYMATTR InstName R95
SYMATTR Value 4.7k
SYMBOL cap 0 -8528 R0
SYMATTR InstName C30
SYMATTR Value 1n
SYMBOL cap 912 -9008 R0
SYMATTR InstName C31
SYMATTR Value 200µ
SYMBOL res 912 -8464 R0
SYMATTR InstName R96
SYMATTR Value 10
SYMBOL cap 1072 -8688 R90
WINDOW 0 0 32 VBottom 2
WINDOW 3 32 32 VTop 2
SYMATTR InstName C32
SYMATTR Value 4.7µ
SYMBOL cap 1072 -8320 R90
WINDOW 0 0 32 VBottom 2
WINDOW 3 32 32 VTop 2
SYMATTR InstName C33
SYMATTR Value 4.7µ
SYMBOL OpAmps\\OP07 1216 -8544 R0
SYMATTR InstName U23
SYMBOL res 1088 -8208 R0
SYMATTR InstName R97
SYMATTR Value 27k
SYMBOL res 1264 -8688 R90
WINDOW 0 0 56 VBottom 2
WINDOW 3 32 56 VTop 2
SYMATTR InstName R98
SYMATTR Value 27k
SYMBOL cap 912 -7952 R0
SYMATTR InstName C34
SYMATTR Value 200µ
SYMBOL cap -384 -8768 R90
WINDOW 0 0 32 VBottom 2
WINDOW 3 32 32 VTop 2
SYMATTR InstName C35
SYMATTR Value 47µ
SYMBOL cap -384 -8224 R90
WINDOW 0 0 32 VBottom 2
WINDOW 3 32 32 VTop 2
SYMATTR InstName C36
SYMATTR Value 47µ
SYMBOL res -288 -8672 R0
SYMATTR InstName R99
SYMATTR Value 4.7k
SYMBOL res -288 -8384 R0
SYMATTR InstName R100
SYMATTR Value 4.7k
SYMBOL diode 1568 -8368 R180
WINDOW 0 24 64 Left 2
WINDOW 3 24 0 Left 2
SYMATTR InstName D1
SYMBOL diode 1536 -8336 R0
SYMATTR InstName D2
SYMBOL res 1488 -8496 R90
WINDOW 0 0 56 VBottom 2
WINDOW 3 32 56 VTop 2
SYMATTR InstName R101
SYMATTR Value 470
SYMBOL res 912 -8640 R0
SYMATTR InstName R102
SYMATTR Value 47
SYMBOL pnp 704 -8816 M180
SYMATTR InstName Q8
SYMBOL res 752 -9152 R0
SYMATTR InstName R103
SYMATTR Value 10
SYMBOL pnp 704 -8112 R0
SYMATTR InstName Q9
SYMBOL res 752 -7712 M180
WINDOW 0 36 76 Left 2
WINDOW 3 36 40 Left 2
SYMATTR InstName R104
SYMATTR Value 10
SYMBOL cap -128 -8640 R0
SYMATTR InstName C37
SYMATTR Value 1n
SYMBOL cap -128 -8352 R0
SYMATTR InstName C38
SYMATTR Value 1n
SYMBOL OpAmps\\OP07 128 -4592 M180
SYMATTR InstName U1
SYMBOL res 704 -4672 R90
WINDOW 0 0 56 VBottom 2
WINDOW 3 32 56 VTop 2
SYMATTR InstName R1
SYMATTR Value 1k
SYMBOL cap 816 -4560 R0
SYMATTR InstName C1
SYMATTR Value 10n
SYMBOL OpAmps\\OP07 992 -4576 M180
SYMATTR InstName U3
SYMBOL res 288 -4640 R0
SYMATTR InstName R2
SYMATTR Value 1k
SYMBOL res 288 -4464 R0
SYMATTR InstName R3
SYMATTR Value 10k
SYMBOL res 1232 -4656 R90
WINDOW 0 0 56 VBottom 2
WINDOW 3 32 56 VTop 2
SYMATTR InstName R4
SYMATTR Value 12k
SYMBOL OpAmps\\OP07 128 -4128 M180
SYMATTR InstName U4
SYMBOL res 704 -4208 R90
WINDOW 0 0 56 VBottom 2
WINDOW 3 32 56 VTop 2
SYMATTR InstName R5
SYMATTR Value 1k
SYMBOL cap 816 -4096 R0
SYMATTR InstName C2
SYMATTR Value 10n
SYMBOL OpAmps\\OP07 992 -4112 M180
SYMATTR InstName U5
SYMBOL res 288 -4176 R0
SYMATTR InstName R6
SYMATTR Value 1k
SYMBOL res 288 -4000 R0
SYMATTR InstName R7
SYMATTR Value 10k
SYMBOL res 1232 -4192 R90
WINDOW 0 0 56 VBottom 2
WINDOW 3 32 56 VTop 2
SYMATTR InstName R8
SYMATTR Value 12k
SYMBOL OpAmps\\OP07 128 -3632 M180
SYMATTR InstName U6
SYMBOL res 704 -3712 R90
WINDOW 0 0 56 VBottom 2
WINDOW 3 32 56 VTop 2
SYMATTR InstName R9
SYMATTR Value 1k
SYMBOL cap 816 -3600 R0
SYMATTR InstName C3
SYMATTR Value 10n
SYMBOL OpAmps\\OP07 992 -3616 M180
SYMATTR InstName U7
SYMBOL res 288 -3680 R0
SYMATTR InstName R10
SYMATTR Value 1k
SYMBOL res 288 -3504 R0
SYMATTR InstName R11
SYMATTR Value 10k
SYMBOL res 1232 -3696 R90
WINDOW 0 0 56 VBottom 2
WINDOW 3 32 56 VTop 2
SYMATTR InstName R12
SYMATTR Value 12k
SYMBOL OpAmps\\OP07 5072 -9216 M180
SYMATTR InstName U13
SYMBOL OpAmps\\OP07 4144 -8160 M180
SYMATTR InstName U14
SYMBOL res 544 -10384 R90
WINDOW 0 0 56 VBottom 2
WINDOW 3 32 56 VTop 2
SYMATTR InstName R13
SYMATTR Value 300
SYMBOL res 528 -10672 R90
WINDOW 0 0 56 VBottom 2
WINDOW 3 32 56 VTop 2
SYMATTR InstName R14
SYMATTR Value 100
SYMBOL res 1296 -10672 R90
WINDOW 0 0 56 VBottom 2
WINDOW 3 32 56 VTop 2
SYMATTR InstName R20
SYMATTR Value 100
SYMBOL res 1296 -10384 R90
WINDOW 0 0 56 VBottom 2
WINDOW 3 32 56 VTop 2
SYMATTR InstName R21
SYMATTR Value 300
SYMBOL bi 320 -10608 R0
SYMATTR InstName B1
SYMATTR Value V=(white(2e5*time)/10000)
SYMBOL bi 1072 -10608 R0
SYMATTR InstName B3
SYMATTR Value V=(white(2e5*time)/10000)
SYMBOL cap 2256 -6256 R90
WINDOW 0 0 32 VBottom 2
WINDOW 3 32 32 VTop 2
SYMATTR InstName C4
SYMATTR Value 3.3n
SYMBOL res 2352 -6256 R90
WINDOW 0 0 56 VBottom 2
WINDOW 3 32 56 VTop 2
SYMATTR InstName R22
SYMATTR Value 6.8k
SYMBOL res 2400 -6560 R180
WINDOW 0 36 76 Left 2
WINDOW 3 36 40 Left 2
SYMATTR InstName R23
SYMATTR Value {R_1}
SYMBOL res 2400 -6336 R180
WINDOW 0 36 76 Left 2
WINDOW 3 36 40 Left 2
SYMATTR InstName R24
SYMATTR Value {101k-R_1}
SYMBOL res 2624 -6560 R180
WINDOW 0 36 76 Left 2
WINDOW 3 36 40 Left 2
SYMATTR InstName R25
SYMATTR Value {R_1}
SYMBOL res 2624 -6336 R180
WINDOW 0 36 76 Left 2
WINDOW 3 36 40 Left 2
SYMATTR InstName R26
SYMATTR Value {101k-R_1}
SYMBOL res 2592 -6240 R0
SYMATTR InstName R27
SYMATTR Value 6.8k
SYMBOL cap 2720 -6224 R0
SYMATTR InstName C5
SYMATTR Value 470p
SYMBOL cap 3056 -6256 R90
WINDOW 0 0 32 VBottom 2
WINDOW 3 32 32 VTop 2
SYMATTR InstName C6
SYMATTR Value 100n
SYMBOL res 3152 -6256 R90
WINDOW 0 0 56 VBottom 2
WINDOW 3 32 56 VTop 2
SYMATTR InstName R28
SYMATTR Value 6.8k
SYMBOL res 3200 -6560 R180
WINDOW 0 36 76 Left 2
WINDOW 3 36 40 Left 2
SYMATTR InstName R29
SYMATTR Value {R_1}
SYMBOL res 3200 -6336 R180
WINDOW 0 36 76 Left 2
WINDOW 3 36 40 Left 2
SYMATTR InstName R30
SYMATTR Value {101k-R_1}
SYMBOL res 3424 -6560 R180
WINDOW 0 36 76 Left 2
WINDOW 3 36 40 Left 2
SYMATTR InstName R31
SYMATTR Value {R_1}
SYMBOL res 3424 -6336 R180
WINDOW 0 36 76 Left 2
WINDOW 3 36 40 Left 2
SYMATTR InstName R32
SYMATTR Value {101k-R_1}
SYMBOL res 3392 -6240 R0
SYMATTR InstName R33
SYMATTR Value 6.8k
SYMBOL cap 3520 -6224 R0
SYMATTR InstName C7
SYMATTR Value 15n
SYMBOL voltage 320 -10032 R0
WINDOW 123 26 137 Left 2
WINDOW 39 0 0 Left 0
WINDOW 3 26 109 Left 2
WINDOW 0 26 10 Left 2
SYMATTR Value2 AC 1
SYMATTR Value SINE(0 0.775m 1k)
SYMATTR InstName V5
SYMBOL res 544 -10080 R90
WINDOW 0 0 56 VBottom 2
WINDOW 3 32 56 VTop 2
SYMATTR InstName R34
SYMATTR Value 300
TEXT -616 -10472 Left 2 ;Pin 1 = Masse / Schirm\nPin 2 = Hot / +\nPin 3 = Cold / -\n \nGrenzfrequenzen:\n200Hz\n3kHz\n12kHz
TEXT -616 -10208 Left 2 !.tran 6m
TEXT -616 -10128 Left 2 ;.param R_1 = 50k
TEXT -608 -10168 Left 2 ;.param R_2=25k
TEXT 2480 -9280 Left 2 ;Höhen f_g 3dB\n226 Hz bis 3.2 kHz\n3.5 kHz bis 50 kHz
TEXT -152 -5696 Left 2 !.param R_3=270 R_4=270 C_1=44n C_2=22n
TEXT -160 -5768 Left 2 !.param C_3=22n R_5=180k R_6=360k
TEXT -600 -10008 Left 2 !.step param R_2 1k 47k 25k
TEXT -592 -9960 Left 2 !.step param R_1 1k 100k 50k
TEXT -80 -6752 Left 2 ;Linkwitz/Riley HP4 \nf_g= 30Hz
TEXT -80 -6320 Left 2 ;Linkwitz/Riley TP4 \nf_g= 20kHz
TEXT 4056 -9288 Left 2 ;Tiefen f_g 3dB\n8 Hz bis 100 Hz\n117 Hz bis 1.5 kHz
RECTANGLE Normal 2048 -10688 -720 -9792 2
RECTANGLE Normal 5744 -7408 3840 -9776 2
RECTANGLE Normal 3840 -9776 2048 -7408 2
RECTANGLE Normal -720 -9792 2048 -7408 2
RECTANGLE Normal 2048 -5184 -720 -7408 2
RECTANGLE Normal 2048 -3136 -720 -5184 2
RECTANGLE Normal 3840 -5184 2048 -7408 2

The netlist it stands for:
* DiKo_Filter.asc
V1 N003 0 SINE(0 0.775m 1k)
V3_+18V +V 0 +18V
V4_-18V -V 0 -18V
XU2 NC_01 NC_02 +V -V NC_03 LT1001  ; OP07, pins In+ In- V+ V- OUT
XU8 EQ_4 N025 +V -V V_3_In LT1001  ; OP07, pins In+ In- V+ V- OUT
R52 N025 V_2_Out 2.2k
R53 V_3_In N025 2.2k
R54 EQ_3 V_2_Out {R_2}
R55 V_3_In EQ_3 {48k-R_2}
C16 P001 N013 3.3n
R56 N017 P001 6.8k
R57 N007 N007 {R_1}
R58 N017 N007 {101k-R_1}
R59 N007 N007 {R_1}
R60 N018 N007 {101k-R_1}
R61 N018 0 6.8k
C17 N007 0 470p
XU9 EQ_3 N013 +V -V N013 LT1001  ; OP07, pins In+ In- V+ V- OUT
XU10 EQ_6 N026 +V -V V_3_Out LT1001  ; OP07, pins In+ In- V+ V- OUT
R63 N026 N029 2.2k
R64 V_3_Out N026 2.2k
R65 EQ_5 N029 {R_2}
R66 V_3_Out EQ_5 {48k-R_2}
C18 P002 N012 100n
R67 N014 P002 6.8k
R68 N006 N006 {R_1}
R69 N014 N006 {101k-R_1}
R70 N006 N006 {R_1}
R71 N016 N006 {101k-R_1}
R72 N016 0 6.8k
C19 N006 0 15n
XU11 EQ_5 N012 +V -V N012 LT1001  ; OP07, pins In+ In- V+ V- OUT
XU12 N041 N037 +V -V N037 LT1001  ; OP07, pins In+ In- V+ V- OUT
C14 N040 V_2_in {C_3}
C15 N041 N040 {C_3}
R15 N037 N040 {R_5}
R16 N041 0 {R_6}
XU17 N050 N042 +V -V N042 LT1001  ; OP07, pins In+ In- V+ V- OUT
R17 N050 N049 {R_4}
R18 N049 V_3_Out {R_3}
C24 N042 N049 {C_1}
C25 N050 0 {C_2}
XU18 N048 V_4_In +V -V V_4_In LT1001  ; OP07, pins In+ In- V+ V- OUT
R19 N048 N047 {R_4}
R46 N047 N042 {R_3}
C26 V_4_In N047 {C_1}
C27 N048 0 {C_2}
XU20 N039 N036 +V -V N036 LT1001  ; OP07, pins In+ In- V+ V- OUT
C28 N038 N037 {C_3}
C29 N039 N038 {C_3}
R47 N036 N038 {R_5}
XU21 N036 V_2_Out +V -V V_2_Out LT1001  ; OP07, pins In+ In- V+ V- OUT
R48 N039 0 {R_6}
XU22 N007 EQ_4 +V -V EQ_4 LT1001  ; OP07, pins In+ In- V+ V- OUT
XU24 V_1_In V_2_in +V -V V_2_in LT1001  ; OP07, pins In+ In- V+ V- OUT
V2 0 N004 SINE(0 0.775m 1k)
Q4 N019 N010 N015 0 PNP
Q5 N019 N010 N009 0 PNP
R49 N008 N015 10
R50 N008 +V 7.5k
R51 N008 N009 10
R62 N019 -V 4.7k
Q6 N028 N030 N032 0 PNP
Q7 N028 N030 N033 0 PNP
R91 N035 N032 10
R92 N035 +V 7.5k
R93 N035 N033 10
R94 N028 -V 4.7k
R95 N010 N030 4.7k
C30 N010 N030 1n
C31 N008 N022 200µ
R96 N024 N031 10
C32 N020 N019 4.7µ
C33 N023 N028 4.7µ
XU23 N023 N020 +V -V N021 LT1001  ; OP07, pins In+ In- V+ V- OUT
R97 N023 0 27k
R98 N021 N020 27k
C34 N031 N035 200µ
C35 N010 Hot 47µ
C36 N030 Cold 47µ
R99 N010 0 4.7k
R100 0 N030 4.7k
D1 N027 V_1_In D
D2 N027 0 D
R101 V_1_In N021 470
R102 N022 N024 47
Q8 N019 N010 N011 0 PNP
R103 N008 N011 10
Q9 N028 N030 N034 0 PNP
R104 N035 N034 10
C37 N010 0 1n
C38 0 N030 1n
XU1 V_4_In N052 +V -V Kippschalter LT1001  ; OP07, pins In+ In- V+ V- OUT
R1 N051 Kippschalter 1k
C1 N051 0 10n
XU3 N051 N053 +V -V N053 LT1001  ; OP07, pins In+ In- V+ V- OUT
R2 Kippschalter N052 1k
R3 N052 0 10k
R4 AUX_1 N053 12k
XU4 V_4_In N055 +V -V Kippschalter LT1001  ; OP07, pins In+ In- V+ V- OUT
R5 N054 Kippschalter 1k
C2 N054 0 10n
XU5 N054 N056 +V -V N056 LT1001  ; OP07, pins In+ In- V+ V- OUT
R6 Kippschalter N055 1k
R7 N055 0 10k
R8 AUX_2 N056 12k
XU6 V_4_In N058 +V -V Kippschalter LT1001  ; OP07, pins In+ In- V+ V- OUT
R9 N057 Kippschalter 1k
C3 N057 0 10n
XU7 N057 N059 +V -V N059 LT1001  ; OP07, pins In+ In- V+ V- OUT
R10 Kippschalter N058 1k
R11 N058 0 10k
R12 BBB N059 12k
XU13 N006 EQ_6 +V -V EQ_6 LT1001  ; OP07, pins In+ In- V+ V- OUT
XU14 V_3_In N029 +V -V N029 LT1001  ; OP07, pins In+ In- V+ V- OUT
R13 Hot N003 300
R14 Hot N001 100
R20 Cold N002 100
R21 Cold N004 300
B1 N001 0 V=(white(2e5*time)/10000)
B3 N002 0 V=(white(2e5*time)/10000)
C4 P003 NC_04 3.3n
R22 N043 P003 6.8k
R23 Höhen Höhen {R_1}
R24 N043 Höhen {101k-R_1}
R25 Höhen Höhen {R_1}
R26 N045 Höhen {101k-R_1}
R27 N045 0 6.8k
C5 Höhen 0 470p
C6 P004 NC_05 100n
R28 N044 P004 6.8k
R29 Tiefen Tiefen {R_1}
R30 N044 Tiefen {101k-R_1}
R31 Tiefen Tiefen {R_1}
R32 N046 Tiefen {101k-R_1}
R33 N046 0 6.8k
C7 Tiefen 0 15n
V5 N005 0 SINE(0 0.775m 1k) AC 1
R34 Test N005 300
.model D D
.lib standard.dio
.model NPN NPN
.model PNP PNP
.lib standard.bjt
* Pin 1 = Masse / Schirm
* Pin 2 = Hot / +
* Pin 3 = Cold / -
* Grenzfrequenzen:
* 200Hz
* 3kHz
* 12kHz
.tran 6m
* .param R_1 = 50k
* .param R_2=25k
* Höhen f_g 3dB
* 226 Hz bis 3.2 kHz
* 3.5 kHz bis 50 kHz
.param R_3=270 R_4=270 C_1=44n C_2=22n
.param C_3=22n R_5=180k R_6=360k
.step param R_2 1k 47k 25k
.step param R_1 1k 100k 50k
* Linkwitz/Riley HP4
* f_g= 30Hz
* Linkwitz/Riley TP4
* f_g= 20kHz
* Tiefen f_g 3dB
* 8 Hz bis 100 Hz
* 117 Hz bis 1.5 kHz
.lib LTC.lib
.backanno
.end